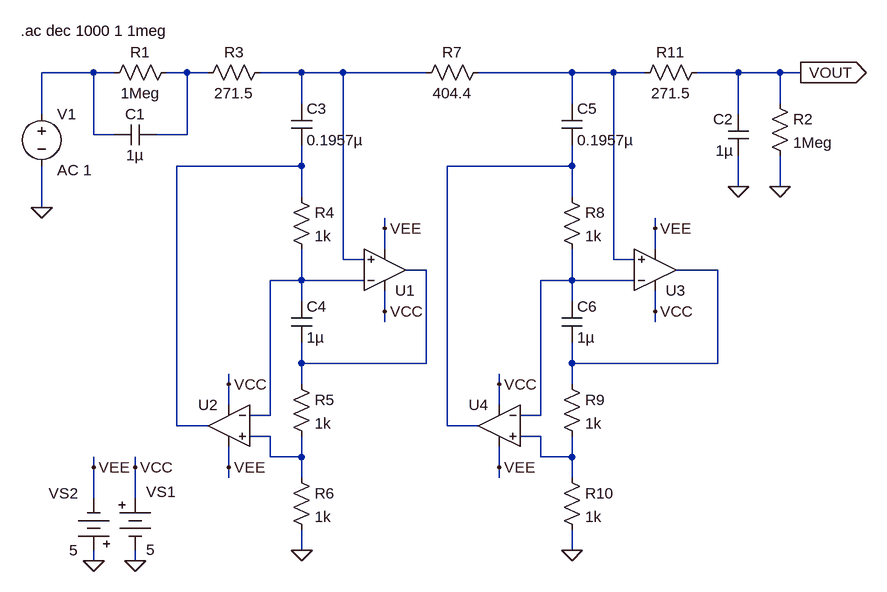
[diagram p0: schematic fig-02-07-08.asc]
fig-02-07-08.asc, the LTspice schematic file:
Version 4
SHEET 1 1268 760
WIRE -272 -208 -352 -208
WIRE -240 -208 -272 -208
WIRE -128 -208 -160 -208
WIRE -96 -208 -128 -208
WIRE 48 -208 -16 -208
WIRE 112 -208 48 -208
WIRE 240 -208 112 -208
WIRE 464 -208 320 -208
WIRE 528 -208 464 -208
WIRE 576 -208 528 -208
WIRE 720 -208 656 -208
WIRE 784 -208 720 -208
WIRE 816 -208 784 -208
WIRE 48 -160 48 -208
WIRE 464 -160 464 -208
WIRE 784 -160 784 -208
WIRE -352 -144 -352 -208
WIRE 720 -144 720 -208
WIRE -272 -112 -272 -208
WIRE -240 -112 -272 -112
WIRE -128 -112 -128 -208
WIRE -128 -112 -176 -112
WIRE 48 -64 48 -96
WIRE 48 -64 -144 -64
WIRE 464 -64 464 -96
WIRE 464 -64 272 -64
WIRE 720 -32 720 -80
WIRE 784 -32 784 -80
WIRE 48 -16 48 -64
WIRE 464 -16 464 -64
WIRE -352 0 -352 -64
WIRE 176 32 176 16
WIRE 592 32 592 16
WIRE 176 64 176 32
WIRE 592 64 592 32
WIRE 112 80 112 -208
WIRE 144 80 112 80
WIRE 528 80 528 -208
WIRE 560 80 528 80
WIRE 240 96 208 96
WIRE 688 96 624 96
WIRE 48 112 48 64
WIRE 48 112 0 112
WIRE 144 112 48 112
WIRE 464 112 464 64
WIRE 464 112 416 112
WIRE 560 112 464 112
WIRE 48 144 48 112
WIRE 464 144 464 112
WIRE 176 160 176 128
WIRE 592 160 592 128
WIRE 176 176 176 160
WIRE 592 176 592 160
WIRE 48 240 48 208
WIRE 240 240 240 96
WIRE 240 240 48 240
WIRE 464 240 464 208
WIRE 688 240 688 96
WIRE 688 240 464 240
WIRE -64 272 -64 256
WIRE 48 272 48 240
WIRE 352 272 352 256
WIRE 464 272 464 240
WIRE -64 304 -64 272
WIRE 352 304 352 272
WIRE 0 320 0 112
WIRE 0 320 -32 320
WIRE 416 320 416 112
WIRE 416 320 384 320
WIRE -144 336 -144 -64
WIRE -96 336 -144 336
WIRE 272 336 272 -64
WIRE 320 336 272 336
WIRE 0 352 -32 352
WIRE 416 352 384 352
WIRE 0 384 0 352
WIRE 48 384 48 352
WIRE 48 384 0 384
WIRE 416 384 416 352
WIRE 464 384 464 352
WIRE 464 384 416 384
WIRE -272 400 -272 384
WIRE -208 400 -208 384
WIRE -64 400 -64 368
WIRE 352 400 352 368
WIRE -64 416 -64 400
WIRE 48 416 48 384
WIRE 352 416 352 400
WIRE 464 416 464 384
WIRE -272 448 -272 400
WIRE -208 448 -208 400
WIRE 48 528 48 496
WIRE 464 528 464 496
WIRE -272 544 -272 528
WIRE -208 544 -208 528
FLAG 48 528 0
FLAG -272 544 0
FLAG -208 544 0
FLAG -272 400 VEE
FLAG -208 400 VCC
FLAG 176 160 VCC
FLAG 176 32 VEE
FLAG -64 272 VCC
FLAG -64 400 VEE
FLAG 784 -32 0
FLAG -352 0 0
FLAG 464 528 0
FLAG 592 160 VCC
FLAG 592 32 VEE
FLAG 352 272 VCC
FLAG 352 400 VEE
FLAG 720 -32 0
FLAG 816 -208 VOUT
IOPIN 816 -208 Out
SYMBOL res 32 -32 R0
SYMATTR InstName R4
SYMATTR Value 1k
SYMBOL Misc\\battery -208 432 R0
WINDOW 0 17 6 Left 2
WINDOW 3 17 95 Left 2
WINDOW 123 0 0 Left 0
WINDOW 39 0 0 Left 0
SYMATTR InstName VS1
SYMATTR Value 5
SYMBOL Misc\\battery -272 544 R180
WINDOW 0 24 104 Left 2
WINDOW 3 24 16 Left 2
WINDOW 123 0 0 Left 0
WINDOW 39 0 0 Left 0
SYMATTR InstName VS2
SYMATTR Value 5
SYMBOL Opamps\\UniversalOpamp2 176 96 M180
SYMATTR InstName U1
SYMATTR Value2 Avol=10Meg GBW=100Meg Slew=10Meg
SYMBOL Opamps\\UniversalOpamp2 -64 336 M0
SYMATTR InstName U2
SYMATTR Value2 Avol=10Meg GBW=100Meg Slew=10Meg
SYMBOL res 32 256 R0
SYMATTR InstName R5
SYMATTR Value 1k
SYMBOL cap 32 -160 R0
SYMATTR InstName C3
SYMATTR Value 0.1957µ
SYMBOL cap 32 144 R0
SYMATTR InstName C4
SYMATTR Value 1µ
SYMBOL res 32 400 R0
SYMATTR InstName R6
SYMATTR Value 1k
SYMBOL res 768 -176 R0
SYMATTR InstName R2
SYMATTR Value 1Meg
SYMBOL res 336 -224 R90
WINDOW 0 0 56 VBottom 2
WINDOW 3 32 56 VTop 2
SYMATTR InstName R7
SYMATTR Value 404.4
SYMBOL res -144 -224 R90
WINDOW 0 0 56 VBottom 2
WINDOW 3 32 56 VTop 2
SYMATTR InstName R1
SYMATTR Value 1Meg
SYMBOL voltage -352 -160 R0
WINDOW 123 24 102 Left 2
WINDOW 39 0 0 Left 0
SYMATTR Value2 AC 1
SYMATTR InstName V1
SYMATTR Value ""
SYMBOL cap -176 -128 R90
WINDOW 0 0 32 VBottom 2
WINDOW 3 32 32 VTop 2
SYMATTR InstName C1
SYMATTR Value 1µ
SYMBOL cap 736 -80 R180
WINDOW 0 24 56 Left 2
WINDOW 3 24 8 Left 2
SYMATTR InstName C2
SYMATTR Value 1µ
SYMBOL res 0 -224 R90
WINDOW 0 0 56 VBottom 2
WINDOW 3 32 56 VTop 2
SYMATTR InstName R3
SYMATTR Value 271.5
SYMBOL res 448 -32 R0
SYMATTR InstName R8
SYMATTR Value 1k
SYMBOL Opamps\\UniversalOpamp2 592 96 M180
SYMATTR InstName U3
SYMATTR Value2 Avol=10Meg GBW=100Meg Slew=10Meg
SYMBOL Opamps\\UniversalOpamp2 352 336 M0
SYMATTR InstName U4
SYMATTR Value2 Avol=10Meg GBW=100Meg Slew=10Meg
SYMBOL res 448 256 R0
SYMATTR InstName R9
SYMATTR Value 1k
SYMBOL cap 448 -160 R0
SYMATTR InstName C5
SYMATTR Value 0.1957µ
SYMBOL cap 448 144 R0
SYMATTR InstName C6
SYMATTR Value 1µ
SYMBOL res 448 400 R0
SYMATTR InstName R10
SYMATTR Value 1k
SYMBOL res 672 -224 R90
WINDOW 0 0 56 VBottom 2
WINDOW 3 32 56 VTop 2
SYMATTR InstName R11
SYMATTR Value 271.5
TEXT -384 -272 Left 2 !.ac dec 1000 1 1meg

The netlist it stands for:
* fig-02-07-08.asc
R4 N005 N009 1k
VS1 VCC 0 5
VS2 0 VEE 5
XU1 N003 N009 VCC VEE N007 level.2 Avol=10Meg GBW=100Meg Slew=10Meg ilimit=25m rail=0 Vos=0 phimargin=45 en=0 enk=0 in=0 ink=0 Rin=500Meg  ; pins IN+ IN- V+ V- OUT
XU2 N011 N009 VCC VEE N005 level.2 Avol=10Meg GBW=100Meg Slew=10Meg ilimit=25m rail=0 Vos=0 phimargin=45 en=0 enk=0 in=0 ink=0 Rin=500Meg  ; pins IN+ IN- V+ V- OUT
R5 N007 N011 1k
C3 N003 N005 0.1957µ
C4 N009 N007 1µ
R6 N011 0 1k
R2 VOUT 0 1Meg
R7 N004 N003 404.4
R1 N002 N001 1Meg
V1 N001 0 AC 1
C1 N002 N001 1µ
C2 0 VOUT 1µ
R3 N003 N002 271.5
R8 N006 N010 1k
XU3 N004 N010 VCC VEE N008 level.2 Avol=10Meg GBW=100Meg Slew=10Meg ilimit=25m rail=0 Vos=0 phimargin=45 en=0 enk=0 in=0 ink=0 Rin=500Meg  ; pins IN+ IN- V+ V- OUT
XU4 N012 N010 VCC VEE N006 level.2 Avol=10Meg GBW=100Meg Slew=10Meg ilimit=25m rail=0 Vos=0 phimargin=45 en=0 enk=0 in=0 ink=0 Rin=500Meg  ; pins IN+ IN- V+ V- OUT
R9 N008 N012 1k
C5 N004 N006 0.1957µ
C6 N010 N008 1µ
R10 N012 0 1k
R11 VOUT N004 271.5
.ac dec 1000 1 1meg
.lib UniversalOpamps2.sub
.backanno
.end